# EAGLE design BMS_slave_board (EAGLE 6.5.0)
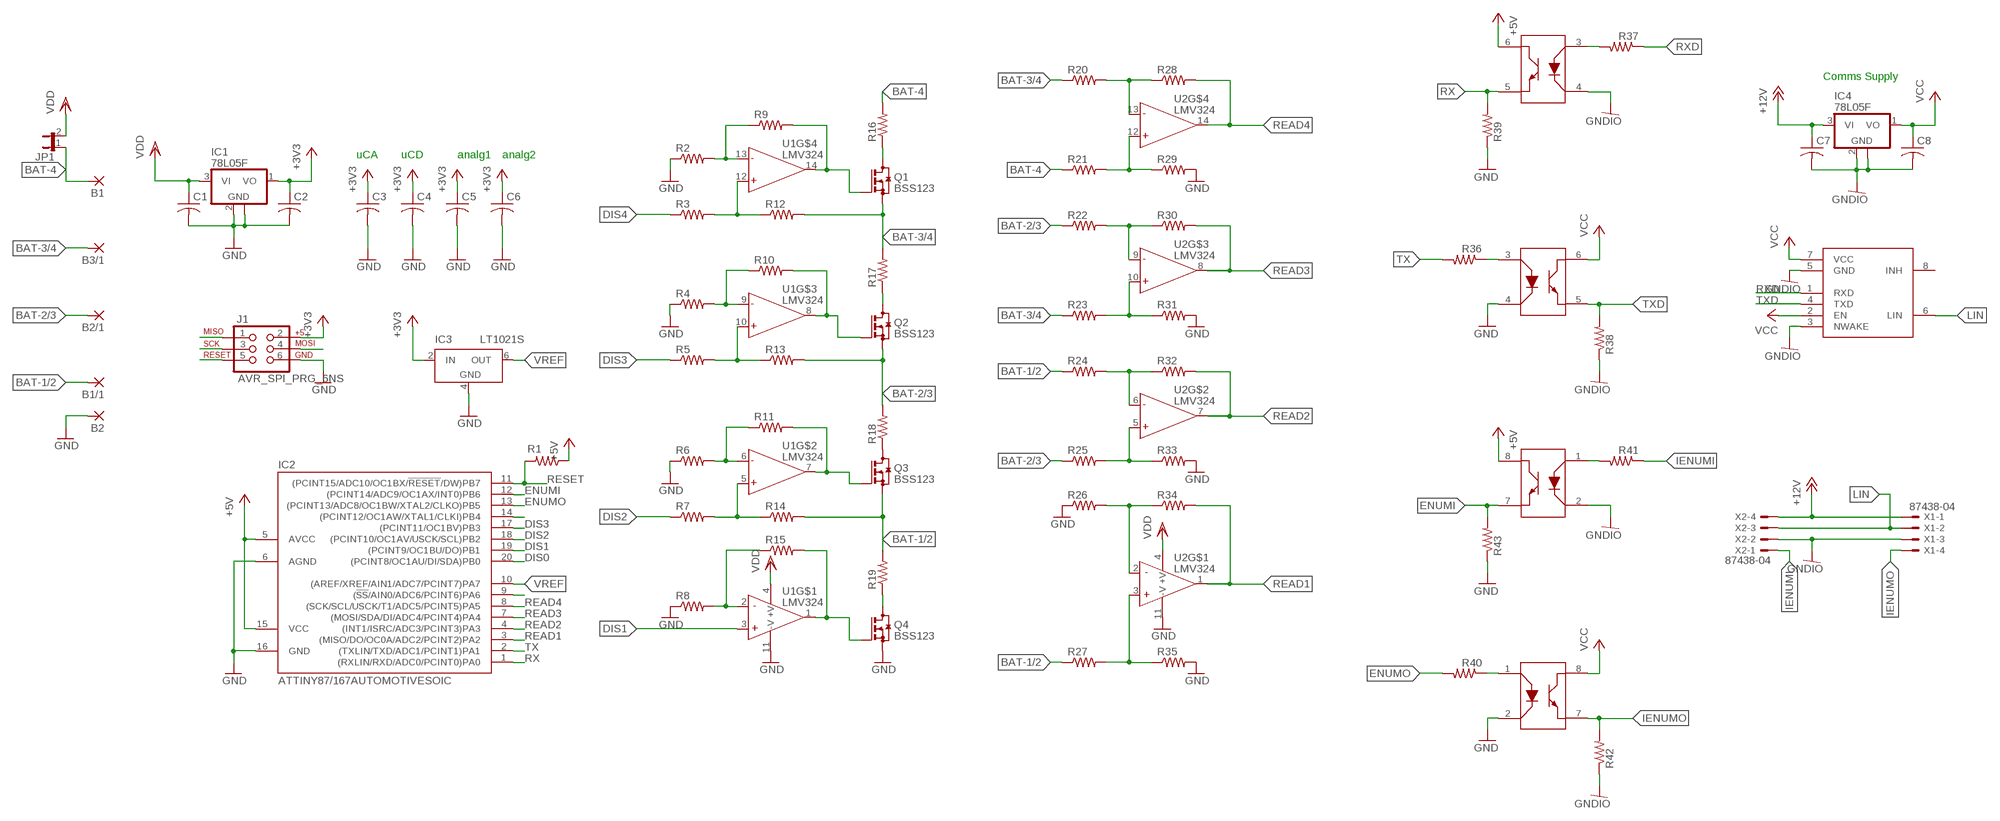
[diagram p0: schematic, sheet 1]

## Parts
B1  2,15/1,0  [2,15/1,0]
B1/1  2,15/1,0  [2,15/1,0]
B2  2,15/1,0  [2,15/1,0]
B2/1  2,15/1,0  [2,15/1,0]
B3/1  2,15/1,0  [2,15/1,0]
C1  C-US025-024X044  [C025-024X044]
C2  C-US025-024X044  [C025-024X044]
C3  C-US025-024X044  [C025-024X044]
C4  C-US025-024X044  [C025-024X044]
C5  C-US025-024X044  [C025-024X044]
C6  C-US025-024X044  [C025-024X044]
C7  C-US025-024X044  [C025-024X044]
C8  C-US025-024X044  [C025-024X044]
IC1  78L05F  [SOT89]
IC2  ATTINY87/167AUTOMOTIVESOIC  [SO20L]
IC3  LT1021S  [SOIC8]
IC4  78L05F  [SOT89]
J1  AVR_SPI_PRG_6NS  [2X3-NS]
JP1  JP1E  [JP1]
Q1  BSS123  [SOT23]
Q2  BSS123  [SOT23]
Q3  BSS123  [SOT23]
Q4  BSS123  [SOT23]
R1  R-US_R0603  [R0603]
R2  R-US_R0603  [R0603]
R3  R-US_R0603  [R0603]
R4  R-US_R0603  [R0603]
R5  R-US_R0603  [R0603]
R6  R-US_R0603  [R0603]
R7  R-US_R0603  [R0603]
R8  R-US_R0603  [R0603]
R9  R-US_R0603  [R0603]
R10  R-US_R0603  [R0603]
R11  R-US_R0603  [R0603]
R12  R-US_R0603  [R0603]
R13  R-US_R0603  [R0603]
R14  R-US_R0603  [R0603]
R15  R-US_R0603  [R0603]
R16  R-US_R0603  [R0603]
R17  R-US_R0603  [R0603]
R18  R-US_R0603  [R0603]
R19  R-US_R0603  [R0603]
R20  R-US_M0805  [M0805]
R21  R-US_R0603  [R0603]
R22  R-US_R0603  [R0603]
R23  R-US_R0603  [R0603]
R24  R-US_R0603  [R0603]
R25  R-US_R0603  [R0603]
R26  R-US_R0603  [R0603]
R27  R-US_R0603  [R0603]
R28  R-US_R0603  [R0603]
R29  R-US_R0603  [R0603]
R30  R-US_R0603  [R0603]
R31  R-US_R0603  [R0603]
R32  R-US_R0603  [R0603]
R33  R-US_R0603  [R0603]
R34  R-US_R0603  [R0603]
R35  R-US_R0603  [R0603]
R36  R-US_R0603  [R0603]
R37  R-US_R0603  [R0603]
R38  R-US_R0603  [R0603]
R39  R-US_R0603  [R0603]
R40  R-US_R0603  [R0603]
R41  R-US_R0603  [R0603]
R42  R-US_R0603  [R0603]
R43  R-US_R0603  [R0603]
U1  LMV324  [SO014]
U2  LMV324  [SO014]
U$1  LTV-827SMD  [SO08]
U$2  LTV-827SMD  [SO08]
U$3  TPIC1021  [SO08]
X1  87438-04  [87438-04]
X2  87438-04  [87438-04]

## Nets
+3V3: C2.1 C3.1 C4.1 C5.1 C6.1 IC1.1(VO) IC3.2(IN) J1.2
+5V: IC2.5(AVCC) IC2.15(VCC) R1.1 U$2.6(CO) U$2.8(CO)
+12V: C7.1 IC4.3(VI) X1.1 X2.4
BAT-1/2: B1/1.1(P) Q3.2(S) R14.2 R19.2 R24.1 R27.1
BAT-2/3: B2/1.1(P) Q2.2(S) R13.2 R18.2 R22.1 R25.1
BAT-3/4: B3/1.1(P) Q1.2(S) R12.2 R17.2 R20.1 R23.1
BAT-4: B1.1(P) JP1.1 R16.2 R21.1
DELDEL: R4.2 R10.1 U1.9(-IN)
DIS0: IC2.20((PCINT8/OC1AU/DI/SDA)PB0)
DIS1: IC2.19((PCINT9/OC1BU/DO)PB1) U1.3(+IN)
DIS2: IC2.18((PCINT10/OC1AV/USCK/SCL)PB2) R7.1
DIS3: IC2.17((PCINT11/OC1BV)PB3) R5.1
DIS4: R3.1
ENUMI: IC2.12((PCINT14/ADC9/OC1AX/INT0)PB6) R43.2 U$2.7(E)
ENUMO: IC2.13((PCINT13/ADC8/OC1BW/XTAL2/CLKO)PB5) R40.2
GND: B2.1(P) C1.2 C2.2 C3.2 C4.2 C5.2 C6.2 IC1.2(GND) IC1.2@1(GND) IC2.6(AGND) IC2.16(GND) IC3.4(GND) J1.6 Q4.2(S) R2.1 R4.1 R6.1 R8.1 R26.1 R29.2 R31.2 R33.2 R35.2 R39.1 R43.1 U1.11(-V) U2.11(-V) U$1.2(CA) U$1.4(CA)
GNDIO: C7.2 C8.2 IC4.2(GND) IC4.2@1(GND) R38.1 R42.1 U$2.2(CA) U$2.4(CA) U$3.3(NWAKE) U$3.5(GND) X1.3 X2.2
IENUMI: R41.1 X2.1
IENUMO: R42.2 U$1.7(E) X1.4
LIN: U$3.6(LIN) X1.2 X2.3
N$1: Q2.3(D) R17.1
N$2: R5.2 R13.1 U1.10(+IN)
N$3: Q3.3(D) R18.1
N$4: R8.2 R15.1 U1.2(-IN)
N$5: Q1.3(D) R16.1
N$6: Q3.1(G) R11.2 U1.7(OUT)
N$7: Q4.3(D) R19.1
N$8: Q4.1(G) R15.2 U1.1(OUT)
N$9: Q2.1(G) R10.2 U1.8(OUT)
N$10: R7.2 R14.1 U1.5(+IN)
N$11: R20.2 R28.1 U2.13(-IN)
N$12: R6.2 R11.1 U1.6(-IN)
N$13: R22.2 R30.1 U2.9(-IN)
N$14: R2.2 R9.1 U1.13(-IN)
N$15: R3.2 R12.1 U1.12(+IN)
N$16: R21.2 R29.1 U2.12(+IN)
N$17: R23.2 R31.1 U2.10(+IN)
N$18: R25.2 R33.1 U2.5(+IN)
N$19: R27.2 R35.1 U2.3(+IN)
N$20: R24.2 R32.1 U2.6(-IN)
N$21: IC2.14((PCINT12/OC1AW/XTAL1/CLKI)PB4)
N$22: R26.2 R34.1 U2.2(-IN)
N$23: R41.2 U$2.1(A)
N$25: R40.1 U$1.1(A)
N$27: R36.1 U$1.3(A)
N$29: R37.2 U$2.3(A)
N$33: Q1.1(G) R9.2 U1.14(OUT)
N$39: IC2.9((!SS!/AIN0/ADC6/PCINT6)PA6)
READ1: IC2.3((MISO/DO/OC0A/ADC2/PCINT2)PA2) J1.1 R34.2 U2.1(OUT)
READ2: IC2.4((INT1/ISRC/ADC3/PCINT3)PA3) R32.2 U2.7(OUT)
READ3: IC2.7((MOSI/SDA/DI/ADC4/PCINT4)PA4) J1.4 R30.2 U2.8(OUT)
READ4: IC2.8((SCK/SCL/USCK/T1/ADC5/PCINT5)PA5) J1.3 R28.2 U2.14(OUT)
RESET: IC2.11((PCINT15/ADC10/OC1BX/!RESET!/DW)PB7) J1.5 R1.2
RX: IC2.1((RXLIN/RXD/ADC0/PCINT0)PA0) R39.2 U$2.5(E)
RXD: R37.1 U$3.1(RXD)
TX: IC2.2((TXLIN/TXD/ADC1/PCINT1)PA1) R36.2
TXD: R38.2 U$1.5(E) U$3.4(TXD)
VCC: C8.1 IC4.1(VO) U$1.6(CO) U$1.8(CO) U$3.2(EN) U$3.7(VCC)
VDD: C1.1 IC1.3(VI) JP1.2 U1.4(+V) U2.4(+V)
VREF: IC2.10((AREF/XREF/AIN1/ADC7/PCINT7)PA7) IC3.6(OUT)
Unconnected: U$3.8(INH)

## Notes on the sheet
- Comms Supply
- uCA | uCD | analg1 | analg2

## Library data of the parts
B1 B1/1 B2 B2/1 B3/1 = wirepad:2,15/1,0: THROUGH-HOLE PAD
C1-C8 = resistor:C-US: CAPACITOR, American symbol
IC1 IC4 = linear:78L*: POSITOIV-VOLTAGE REGULATORS Output up to 100 mA Source: http://focus.ti.com/lit/ds/symlink/ua78l05.pdf
IC2 = EVT-Eagle-Library:ATTINY87/167AUTOMOTIVE
IC3 = linear-technology:LT1021: Precision Reference Source: http://www.linear.com/pc/downloadDocument.do?navId=H0,C1,C1010,C1603,P1229,D2805; MPN: LT1021DCS8-10#PBF; OC_FARNELL: 1273428; OC_NEWARK: 57M0993
J1 = SparkFun-Connectors:AVR_SPI_PRG_6: AVR ISP 6 Pin This is the reduced ISP connector for AVR programming. Common on Arduino. This footprint will take up less PCB space and can be used with a 10-pin to 6-pin adapter such as SKU: BOB-08508
JP1 = jumper:JP1E: JUMPER
Q1-Q4 = transistor-small-signal:BSS123: N-CHANNEL MOS FET
R1-R43 = rcl:R-US_: RESISTOR, American symbol
U1 U2 = SparkFun-AnalogIC:LMV324: Jellybean quad op-amp; PROD_ID: IC-08227
U$1 U$2 = EVT-Eagle-Library:LTV-827
U$3 = EVT-Eagle-Library:TPIC1021
X1 X2 = con-molex:87438-04: Wire-to-Board 1.50mm (.059") Pitch Header - Right Angle, SMT, Shrouded Source: http://www.molex.com/product/micro/87438.html; OC_FARNELL: unknown; OC_NEWARK: unknown

## Board
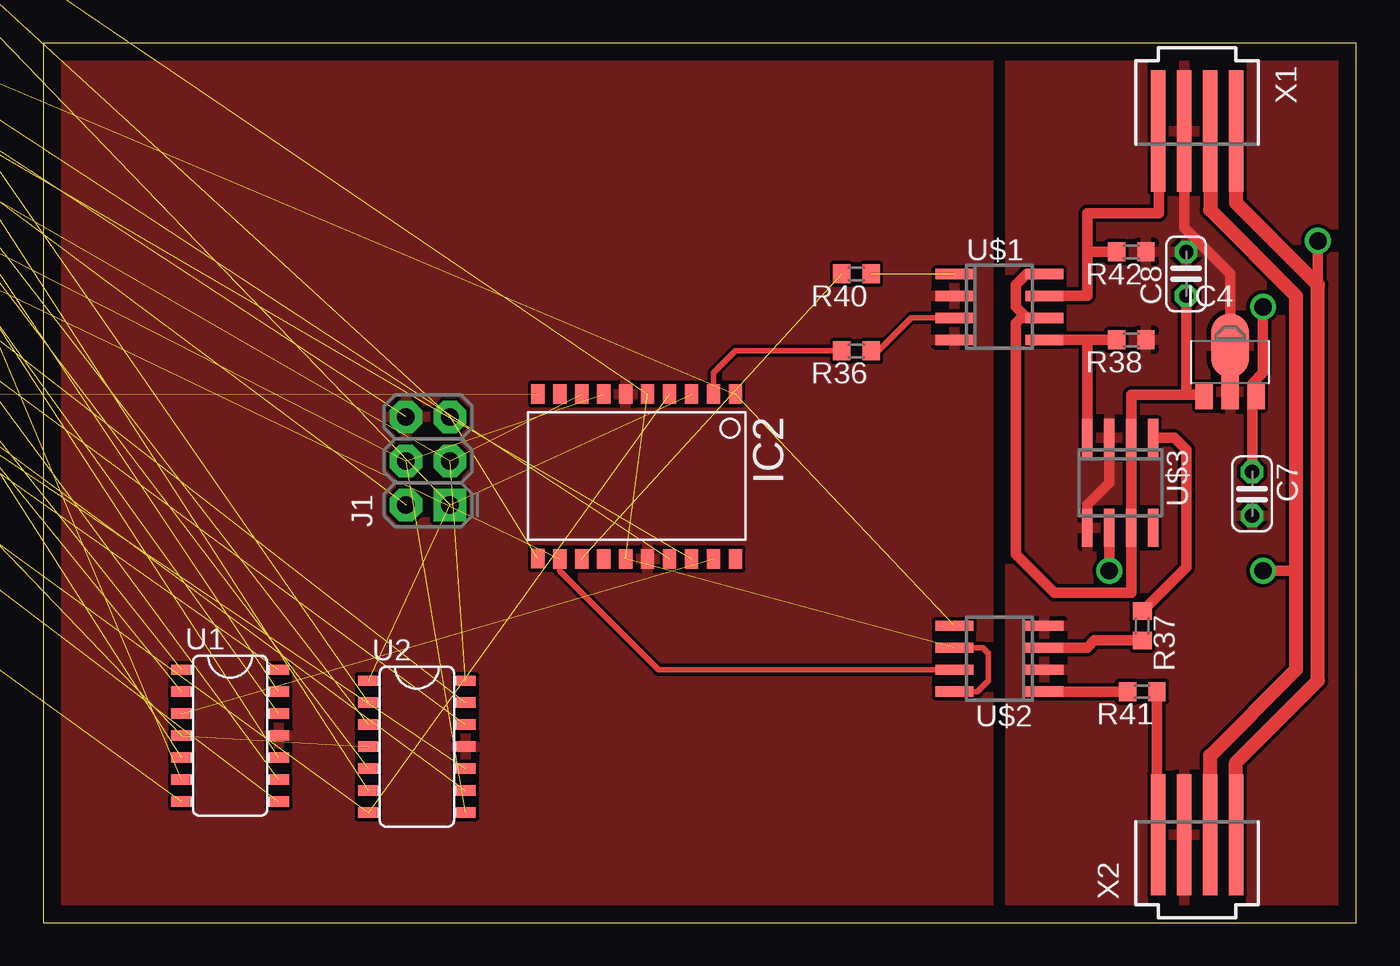
[diagram p1: board, top side]
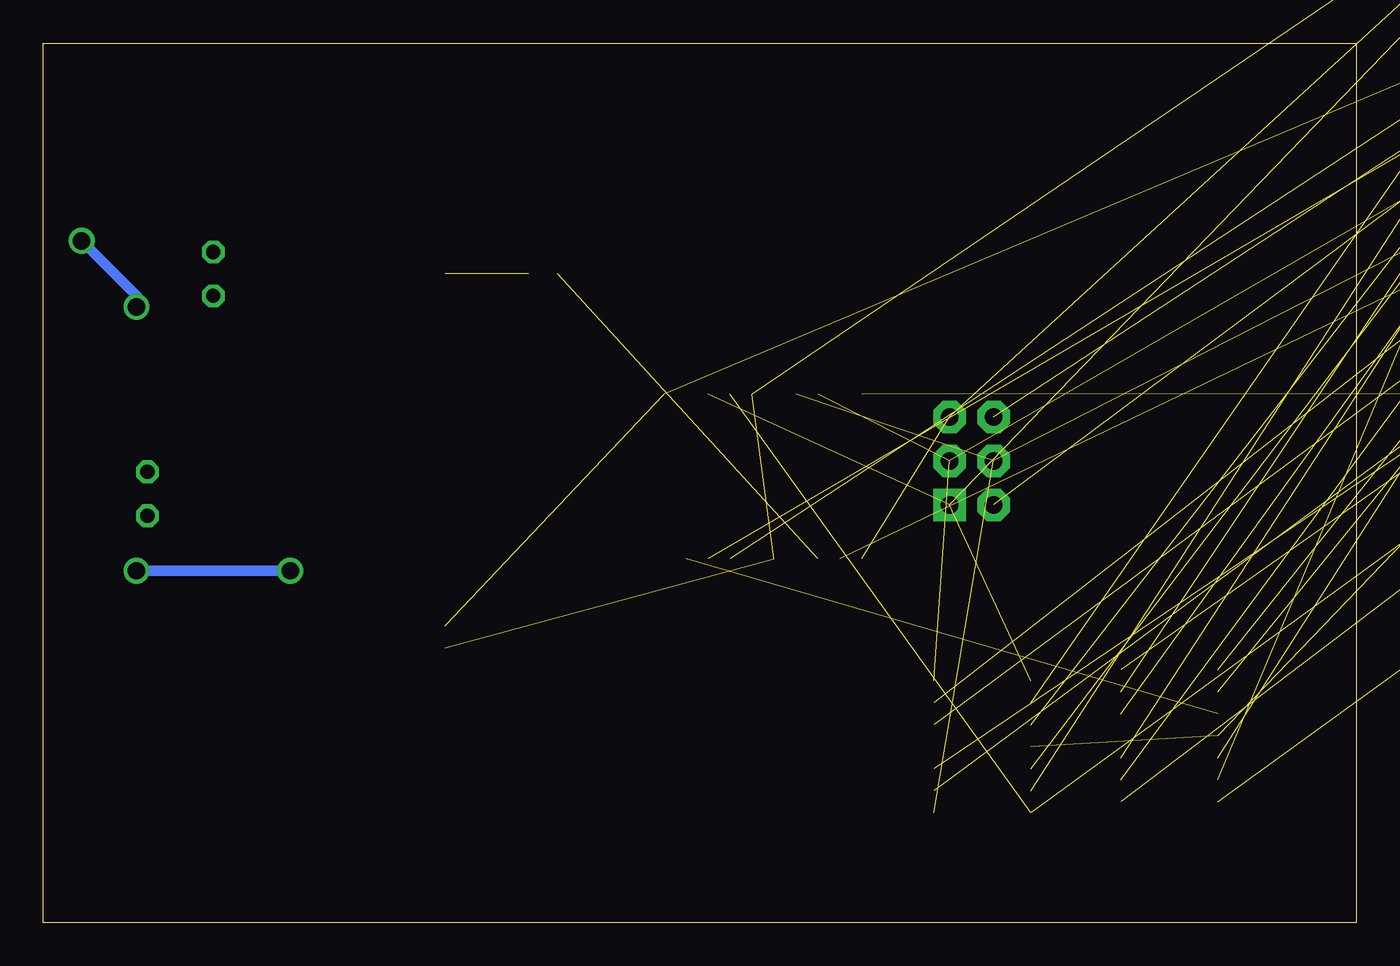
[diagram p2: board, bottom side, seen from below]

Size 75.87 x 50.79 mm. Coordinates in mm from the lower left corner, seen from the top.
Outline: 0,0 75.87,0 75.87,50.79 0,50.79 0,0
Copper layers (1*16): Top 0.035mm / dielectric 1.5mm / Bottom 0.035mm
Design rules "default": minimum track width 10mil, minimum drill 24mil, track to track 8mil, track to pad 8mil, pad to pad 8mil, via to via 8mil, smd to smd 8mil, copper to edge 40mil, drill to drill 8mil, minimum pad ring 10mil, minimum via ring 8mil, stop-mask expansion 4mil, vias tented up to drill 0mil, thermal gap 10mil

### Footprints (pad centres in the part's own frame; a part is rotated, then mirrored left to right if it is on the bottom)
2,15/1,0 = drill 1.016 pad 2.159 octagon: 1 0,0
C025-024X044 = drill 0.813 octagon: 1 -1.27,0; 2 1.27,0
SOT89 = smd 1 x 1.5: 1 -1.499,-1.981; 3 1.499,-1.981 | smd 1 x 2: 2 0,-1.727 | smd 2.2 x 3.7: 2@1 0,0.94
SO20L = smd 0.762 x 1.143: 1 -5.08,-5.131; 2 -3.81,-5.131; 3 -2.54,-5.131; 4 -1.27,-5.131; 5 0,-5.131; 6 1.27,-5.131; 7 2.54,-5.131; 8 3.81,-5.131; 9 5.08,-5.131; 10 6.35,-5.131; 11 6.35,4.369; 12 5.08,4.394; 13 3.81,4.394; 14 2.54,4.394; 15 1.27,4.394; 16 0,4.394; 17 -1.27,4.394; 18 -2.54,4.394; 19 -3.81,4.394; 20 -5.08,4.394
SOIC8 = smd 0.6 x 2.2: 1 -1.905,-2.6; 2 -0.635,-2.6; 3 0.635,-2.6; 4 1.905,-2.6; 5 1.905,2.6; 6 0.635,2.6; 7 -0.635,2.6; 8 -1.905,2.6
2X3-NS = drill 1.016 pad 1.88 square: 1 -2.54,-1.27 | drill 1.016 pad 1.88 octagon: 2 -2.54,1.27; 3 0,-1.27; 4 0,1.27; 5 2.54,-1.27; 6 2.54,1.27
JP1 = drill 0.914 long: 1 0,-1.27; 2 0,1.27
SOT23 = smd 1 x 1.4: 1 -0.95,-1.1; 2 0.95,-1.1; 3 0,1.1
R0603 = smd 1 x 1.1: 1 -0.85,0; 2 0.85,0
M0805 = smd 1.3 x 1.6: 1 -0.95,0; 2 0.95,0
SO014 = smd 0.6 x 1.2: 1 -3.175,-2.8; 2 -1.905,-2.8; 3 -0.635,-2.8; 4 0.635,-2.8; 5 1.905,-2.8; 6 3.175,-2.8; 7 4.445,-2.8; 8 4.445,2.8; 9 3.175,2.8; 10 1.905,2.8; 11 0.635,2.8; 12 -0.635,2.8; 13 -1.905,2.8; 14 -3.175,2.8
SO08 = smd 0.6 x 2.2: 1 -1.905,-2.6; 2 -0.635,-2.6; 3 0.635,-2.6; 4 1.905,-2.6; 5 1.905,2.6; 6 0.635,2.6; 7 -0.635,2.6; 8 -1.905,2.6
87438-04 = smd 7 x 0.85: 1 0,2.25; 2 0,0.75; 3 0,-0.75; 4 0,-2.25

### Placement (x,y rotation side)
B1  -40.64,52.07 0 top  (outside the outline)
B1/1  -35.56,44.45 0 top  (outside the outline)
B2  -44.45,52.07 0 top  (outside the outline)
B2/1  -40.64,44.45 0 top  (outside the outline)
B3/1  -45.72,44.45 0 top  (outside the outline)
C1  -50.8,44.45 0 top  (outside the outline)
C2  -55.88,44.45 0 top  (outside the outline)
C3  -60.96,44.45 0 top  (outside the outline)
C4  -15.24,52.07 0 top  (outside the outline)
C5  -20.32,52.07 0 top  (outside the outline)
C6  -25.4,52.07 0 top  (outside the outline)
C7  69.85,24.77 270 top
C8  66.04,37.47 90 top
IC1  -45.72,29.21 0 top  (outside the outline)
IC2  34.92,25.4 180 top
IC3  -60.96,27.94 0 top  (outside the outline)
IC4  68.58,32.38 0 top
J1  22.23,26.67 90 top
JP1  -27.94,46.99 0 top  (outside the outline)
Q1  -19.05,39.37 0 top  (outside the outline)
Q2  -26.67,39.37 0 top  (outside the outline)
Q3  -34.29,39.37 0 top  (outside the outline)
Q4  -41.91,39.37 0 top  (outside the outline)
R1  -20.32,68.58 0 top  (outside the outline)
R2  -24.13,68.58 0 top  (outside the outline)
R3  -27.94,68.58 0 top  (outside the outline)
R4  -31.75,68.58 0 top  (outside the outline)
R5  -35.56,68.58 0 top  (outside the outline)
R6  -39.37,68.58 0 top  (outside the outline)
R7  -43.18,68.58 0 top  (outside the outline)
R8  -46.99,68.58 0 top  (outside the outline)
R9  -50.8,68.58 0 top  (outside the outline)
R10  -55.88,52.07 0 top  (outside the outline)
R11  -16.51,68.58 0 top  (outside the outline)
R12  -60.96,52.07 0 top  (outside the outline)
R13  -16.51,57.15 0 top  (outside the outline)
R14  -21.59,57.15 0 top  (outside the outline)
R15  -26.67,57.15 0 top  (outside the outline)
R16  -31.75,57.15 0 top  (outside the outline)
R17  -36.83,57.15 0 top  (outside the outline)
R18  -41.91,57.15 0 top  (outside the outline)
R19  -46.99,57.15 0 top  (outside the outline)
R20  -49.53,52.07 0 top  (outside the outline)
R21  -52.07,57.15 0 top  (outside the outline)
R22  -57.15,57.15 0 top  (outside the outline)
R23  -62.23,57.15 0 top  (outside the outline)
R24  -16.51,60.96 0 top  (outside the outline)
R25  -21.59,60.96 0 top  (outside the outline)
R26  -26.67,60.96 0 top  (outside the outline)
R27  -31.75,60.96 0 top  (outside the outline)
R28  -36.83,60.96 0 top  (outside the outline)
R29  -41.91,60.96 0 top  (outside the outline)
R30  -46.99,60.96 0 top  (outside the outline)
R31  -52.07,60.96 0 top  (outside the outline)
R32  -57.15,60.96 0 top  (outside the outline)
R33  -62.23,60.96 0 top  (outside the outline)
R34  -16.51,64.77 0 top  (outside the outline)
R35  -21.59,64.77 0 top  (outside the outline)
R36  46.99,33.02 180 top
R37  63.5,17.14 270 top
R38  62.87,33.66 180 top
R39  -41.91,64.77 0 top  (outside the outline)
R40  46.99,37.47 180 top
R41  63.5,13.34 180 top
R42  62.87,38.73 180 top
R43  -62.23,64.77 0 top  (outside the outline)
U1  10.79,11.43 270 top
U2  21.59,10.79 270 top
U$1  55.24,35.56 270 top
U$2  55.24,15.24 90 top
U$3  62.23,25.4 180 top
X1  66.67,45.72 270 top
X2  66.67,5.08 90 top

### Tracks (layer width: path | path; a pad name or v marks a point on that pad's centre or on a via)
+3V3  (7 unrouted)
+5V  (3 unrouted)
  Top 0.305: U$2.8 53.98,13.34 54.61,13.97 54.61,15.56 54.29,15.88 U$2.6
+12V  (via drill 1)
  Top 0.61: v70.48,35.56 70.48,31.75 69.85,31.11 69.85,30.48 IC4.3 69.85,29.84 C7.1 | v73.66,39.37 73.66,36.83
  Top 0.813: X1.1 68.92,41.56 73.66,36.83 73.66,13.97 68.92,9.23 X2.4
  Bottom 0.61: v73.66,39.37 70.48,36.2 v70.48,35.56
BAT-1/2  (5 unrouted)
BAT-2/3  (5 unrouted)
BAT-3/4  (5 unrouted)
BAT-4  (3 unrouted)
DELDEL  (2 unrouted)
DIS1  (1 unrouted)
DIS2  (1 unrouted)
DIS3  (1 unrouted)
ENUMI  (1 unrouted)
  Top 0.305: U$2.7 35.56,14.61 29.84,20.32 IC2.12
ENUMO  (1 unrouted)
GND  (22 unrouted)
  pour Top: 54.61,50.8 54.61,0 0,0 0,50.8
GNDIO
  Top 0.61: X1.3 65.92,40.12 68.58,37.47 IC4.2@1 IC4.2 | U$3.3 61.59,25.4 60.33,24.13 U$3.5
  pour Top: 75.56,50.8 75.56,0 55.88,0 55.88,50.8
IENUMI
  Top 0.61: R41.1 64.35,5.16 X2.1
IENUMO
  Top 0.61: U$1.7 60.33,36.2 60.33,38.73 | 60.33,38.73 60.33,40.96 64.45,40.96 64.45,45.72 X1.4 | R42.2 60.33,38.73
LIN  (via drill 1)
  Top 0.61: v70.48,20.32 72.39,20.32 | U$3.6 v61.59,20.32
  Top 0.813: X1.2 67.42,41.16 72.39,36.2 72.39,20.32 72.39,14.61 67.42,9.64 X2.3
  Bottom 0.61: v61.59,20.32 v70.48,20.32
N$1  (1 unrouted)
N$2  (2 unrouted)
N$3  (1 unrouted)
N$4  (2 unrouted)
N$5  (1 unrouted)
N$6  (2 unrouted)
N$7  (1 unrouted)
N$8  (2 unrouted)
N$9  (2 unrouted)
N$10  (2 unrouted)
N$11  (2 unrouted)
N$12  (2 unrouted)
N$13  (2 unrouted)
N$14  (2 unrouted)
N$15  (2 unrouted)
N$16  (2 unrouted)
N$17  (2 unrouted)
N$18  (2 unrouted)
N$19  (2 unrouted)
N$20  (2 unrouted)
N$22  (2 unrouted)
N$23
  Top 0.61: R41.2 U$2.1
N$25  (1 unrouted)
N$27
  Top 0.305: U$1.3 50.16,34.92 48.26,33.02 R36.1
N$29
  Top 0.61: R37.2 60.74,16.3 60.33,15.88 U$2.3
N$33  (2 unrouted)
READ1  (3 unrouted)
READ2  (2 unrouted)
READ3  (3 unrouted)
READ4  (3 unrouted)
RESET  (2 unrouted)
RX  (2 unrouted)
RXD
  Top 0.61: U$3.1 65.34,28 66.04,27.3 66.04,20.54 R37.1
TX
  Top 0.305: R36.2 40.01,33.02 38.73,31.75 IC2.2
TXD
  Top 0.61: U$1.5 60.33,33.66 | 60.33,33.66 U$3.4 | R38.2 60.33,33.66
VCC
  Top 0.61: U$1.8 56.83,37.47 56.2,36.83 56.2,35.56 56.83,34.92 U$1.6 56.52,34.92 56.2,34.61 56.2,21.27 58.42,19.05 62.87,19.05 U$3.7 U$3.2 62.87,30.48 66.04,30.48 | 66.04,30.48 67,30.48 IC4.1 | C8.1 66.04,30.48
VDD  (4 unrouted)
VREF  (1 unrouted)